# EAGLE design schema (EAGLE 9.6.2)
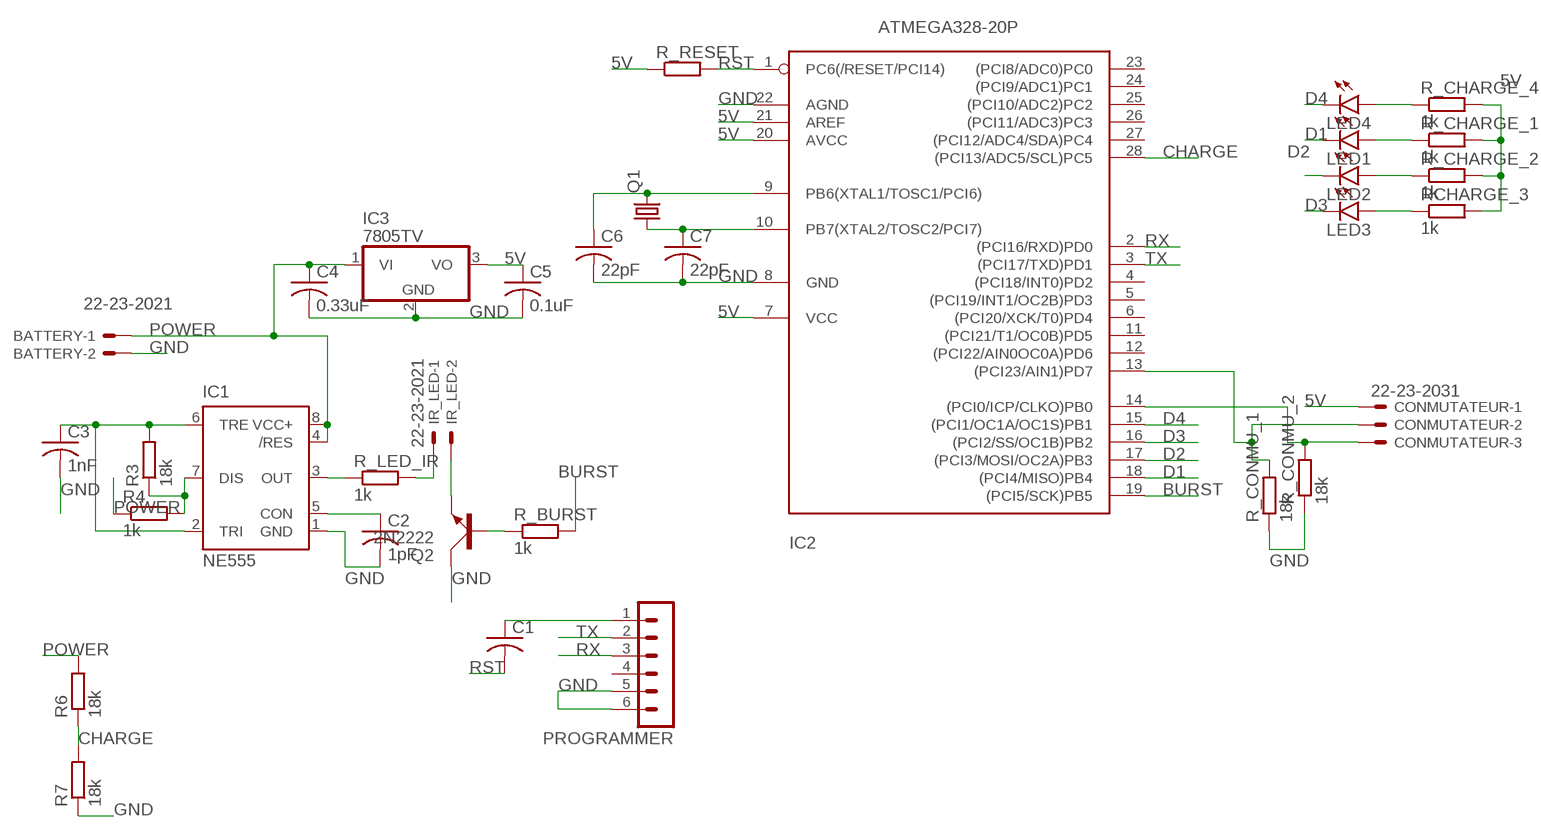
[diagram p0: schematic, sheet 1]

## Parts
BATTERY  22-23-2021  [22-23-2021]
C1  C-US050-024X044  [C050-024X044]
C2  1pF  C-US050-024X044  [C050-024X044]
C3  1nF  C-US050-024X044  [C050-024X044]
C4  0.33uF  C-US050-024X044  [C050-024X044]
C5  0.1uF  C-US050-024X044  [C050-024X044]
C6  22pF  C-US050-024X044  [C050-024X044]
C7  22pF  C-US050-024X044  [C050-024X044]
CONMUTATEUR  22-23-2031  [22-23-2031]
IC1  NE555  [DIL-08]
IC2  ATMEGA328-20P  [DIL28-3]
IC3  7805TV  [TO220V]
IR_LED  22-23-2021  [22-23-2021]
LED1  LED5MM  [LED5MM]
LED2  LED5MM  [LED5MM]
LED3  LED5MM  [LED5MM]
LED4  LED5MM  [LED5MM]
PROGRAMMER  MA06-1  [MA06-1]
Q1  CRYSTALHC49S  [HC49/S]
Q2  2N2222  [TO18A]
R3  18k  R-EU_0207/7  [0207/7]
R4  1k  R-EU_0207/7  [0207/7]
R6  18k  R-EU_0207/7  [0207/7]
R7  18k  R-EU_0207/7  [0207/7]
R_BURST  1k  R-EU_0207/7  [0207/7]
R_CHARGE_1  1k  R-EU_0207/7  [0207/7]
R_CHARGE_2  1k  R-EU_0207/7  [0207/7]
R_CHARGE_4  1k  R-EU_0207/7  [0207/7]
R_CONMU_1  18k  R-EU_0207/7  [0207/7]
R_CONMU_2  18k  R-EU_0207/7  [0207/7]
R_LED_IR  1k  R-EU_0207/7  [0207/7]
R_RESET  R-EU_0207/7  [0207/7]
RCHARGE_3  1k  R-EU_0207/7  [0207/7]

## Nets
5V: C5.1 CONMUTATEUR.1 IC2.7(VCC) IC2.20(AVCC) IC2.21(AREF) IC3.3(VO) R_CHARGE_1.2 R_CHARGE_2.2 R_CHARGE_4.2 R_RESET.1 RCHARGE_3.2
BURST: IC2.19((PCI5/SCK)PB5) R_BURST.2
CHARGE: IC2.28((PCI13/ADC5/SCL)PC5) R6.1 R7.2
D1: IC2.18((PCI4/MISO)PB4) LED1.K(C)
D2: IC2.17((PCI3/MOSI/OC2A)PB3) LED2.K(C)
D3: IC2.16((PCI2/SS/OC1B)PB2) LED3.K(C)
D4: IC2.15((PCI1/OC1A/OC1S)PB1) LED4.K(C)
GND: BATTERY.2 C2.2 C3.2 C4.2 C5.2 C6.2 C7.2 IC1.1(GND) IC2.8(GND) IC2.22(AGND) IC3.2(GND) PROGRAMMER.5 PROGRAMMER.6 Q2.C R7.1 R_CONMU_1.1 R_CONMU_2.1
N$1: IR_LED.1 R_LED_IR.2
N$2: IC1.3(OUT) R_LED_IR.1
N$3: C2.1 IC1.5(CON)
N$4: IC1.7(DIS) R3.1 R4.2
N$5: C3.1 IC1.2(TRI) IC1.6(TRE) R3.2
N$6: IR_LED.2 Q2.E
N$8: CONMUTATEUR.2 IC2.13((PCI23/AIN1)PD7) R_CONMU_1.2
N$9: C7.1 IC2.10(PB7(XTAL2/TOSC2/PCI7)) Q1.1
N$10: C6.1 IC2.9(PB6(XTAL1/TOSC1/PCI6)) Q1.2
N$11: Q2.B R_BURST.1
N$12: CONMUTATEUR.3 IC2.14((PCI0/ICP/CLKO)PB0) R_CONMU_2.2
N$15: LED3.A RCHARGE_3.1
N$16: LED2.A R_CHARGE_2.1
N$17: LED1.A R_CHARGE_1.1
N$18: LED4.A R_CHARGE_4.1
N$19: C1.1 PROGRAMMER.1
POWER: BATTERY.1 C4.1 IC1.4(/RES) IC1.8(VCC+) IC3.1(VI) R4.1 R6.2
RST: C1.2 IC2.1(PC6(/RESET/PCI14)) R_RESET.2
RX: IC2.2((PCI16/RXD)PD0) PROGRAMMER.3
TX: IC2.3((PCI17/TXD)PD1) PROGRAMMER.2
Unconnected: IC2.4((PCI18/INT0)PD2) IC2.5((PCI19/INT1/OC2B)PD3) IC2.6((PCI20/XCK/T0)PD4) IC2.11((PCI21/T1/OC0B)PD5) IC2.12((PCI22/AIN0OC0A)PD6) IC2.23((PCI8/ADC0)PC0) IC2.24((PCI9/ADC1)PC1) IC2.25((PCI10/ADC2)PC2) IC2.26((PCI11/ADC3)PC3) IC2.27((PCI12/ADC4/SDA)PC4) PROGRAMMER.4

## Library data of the parts
BATTERY IR_LED = con-molex:22-23-2021: .100" (2.54mm) Center Header - 2 Pin; MF: MOLEX; MPN: 22-23-2021; OC_FARNELL: 1462926; OC_NEWARK: 25C3832
C1-C7 = rcl:C-US: CAPACITOR, American symbol; SPICEPREFIX: C
CONMUTATEUR = con-molex:22-23-2031: .100" (2.54mm) Center Header - 3 Pin; MF: MOLEX; MPN: 22-23-2031; OC_FARNELL: 1462950; OC_NEWARK: 30C0862
IC1 = st-microelectronics:NE555: General purpose bipolar Timer; MF: Arrow Electronics; MPN: NE555N; OC_FARNELL: 1467742; OC_NEWARK: 89K1486
IC2 = atmega328:ATMEGA328*P: MICROCONTROLLER 32 kBytes FLASH 2 kBytes SRAM 1 kBytes EEPROM USART 8-channel 10 bit ADC
IC3 = linear:78*: Positive VOLTAGE REGULATOR Source: http://cache.national.com/ds/LM/LM78L05.pdf http://www.fairchildsemi.com/ds/LM/LM7805.pdf
LED1-LED4 = led:LED: LED OSRAM: - CHIPLED LG R971, LG N971, LY N971, LG Q971, LY Q971, LO R971, LY R971 LH N974, LH R974 LS Q976, LO Q976, LY Q976 LO Q996 - Hyper CHIPLED LW Q18S LB Q993, LB Q99A, LB R99A - SideLED LS A670, LO A670, LY A670, LG A670, LP A670 LB A673, LV A673, LT A673, LW A673 LH A674 LY A675 LS A676, LA A676, LO A676, LY A676, LW A676 LS A679, LY A679, LG A679 - Hyper Micro SIDELED® LS Y876, LA Y876, LO Y876, LY Y876 LT Y87S - SmartLED LW L88C, LW L88S LB L89C, LB L89S, LG L890 LS L89K, LO L89K, LY L89K LS L896, LA L896, LO L896, LY L896 - TOPLED LS T670, LO T670, LY T670, LG T670, LP T670 LSG T670, LSP T670, LSY T670, LOP T670, LYG T670 LG T671, LOG T671, LSG T671 LB T673, LV T673, LT T673, LW T673 LH T674 LS T676, LA T676, LO T676, LY T676, LB T676, LH T676, LSB T676, LW T676 LB T67C, LV T67C, LT T67C, LS T67K, LO T67K, LY T67K, LW E67C LS E67B, LA E67B, LO E67B, LY E67B, LB E67C, LV E67C, LT E67C LW T67C LS T679, LY T679, LG T679 LS T770, LO T770, LY T770, LG T770, LP T770 LB T773, LV T773, LT T773, LW T773 LH T774 LS E675, LA E675, LY E675, LS T675 LS T776, LA T776, LO T776, LY T776, LB T776 LHGB T686 LT T68C, LB T68C - Hyper Mini TOPLED® LB M676 - Mini TOPLED Santana® LG M470 LS M47K, LO M47K, LY M47K Source: http://www.osram.convergy.de LUXEON: - LUMILED® LXK2-PW12-R00, LXK2-PW12-S00, LXK2-PW14-U00, LXK2-PW14-V00 LXK2-PM12-R00, LXK2-PM12-S00, LXK2-PM14-U00 LXK2-PE12-Q00, LXK2-PE12-R00, LXK2-PE12-S00, LXK2-PE14-T00, LXK2-PE14-U00 LXK2-PB12-K00, LXK2-PB12-L00, LXK2-PB12-M00, LXK2-PB14-N00, LXK2-PB14-P00, LXK2-PB14-Q00 LXK2-PR12-L00, LXK2-PR12-M00, LXK2-PR14-Q00, LXK2-PR14-R00 LXK2-PD12-Q00, LXK2-PD12-R00, LXK2-PD12-S00 LXK2-PH12-R00, LXK2-PH12-S00 LXK2-PL12-P00, LXK2-PL12-Q00, LXK2-PL12-R00 Source: www.luxeon.com KINGBRIGHT: KA-3528ASYC Source: www.kingbright.com
PROGRAMMER = con-lstb:MA06-1: PIN HEADER; OC_FARNELL: unknown; OC_NEWARK: unknown
Q1 = crystal:CRYSTAL: CRYSTAL; OC_FARNELL: 1667008; OC_NEWARK: unknown
Q2 = transistor-small-signal:2N2222: NPN TRANSISTOR
R3 R4 R6 R7 R_BURST R_CHARGE_1 R_CHARGE_2 R_CHARGE_4 R_CONMU_1 R_CONMU_2 R_LED_IR R_RESET RCHARGE_3 = rcl:R-EU_: RESISTOR, European symbol; SPICEPREFIX: R

## Board
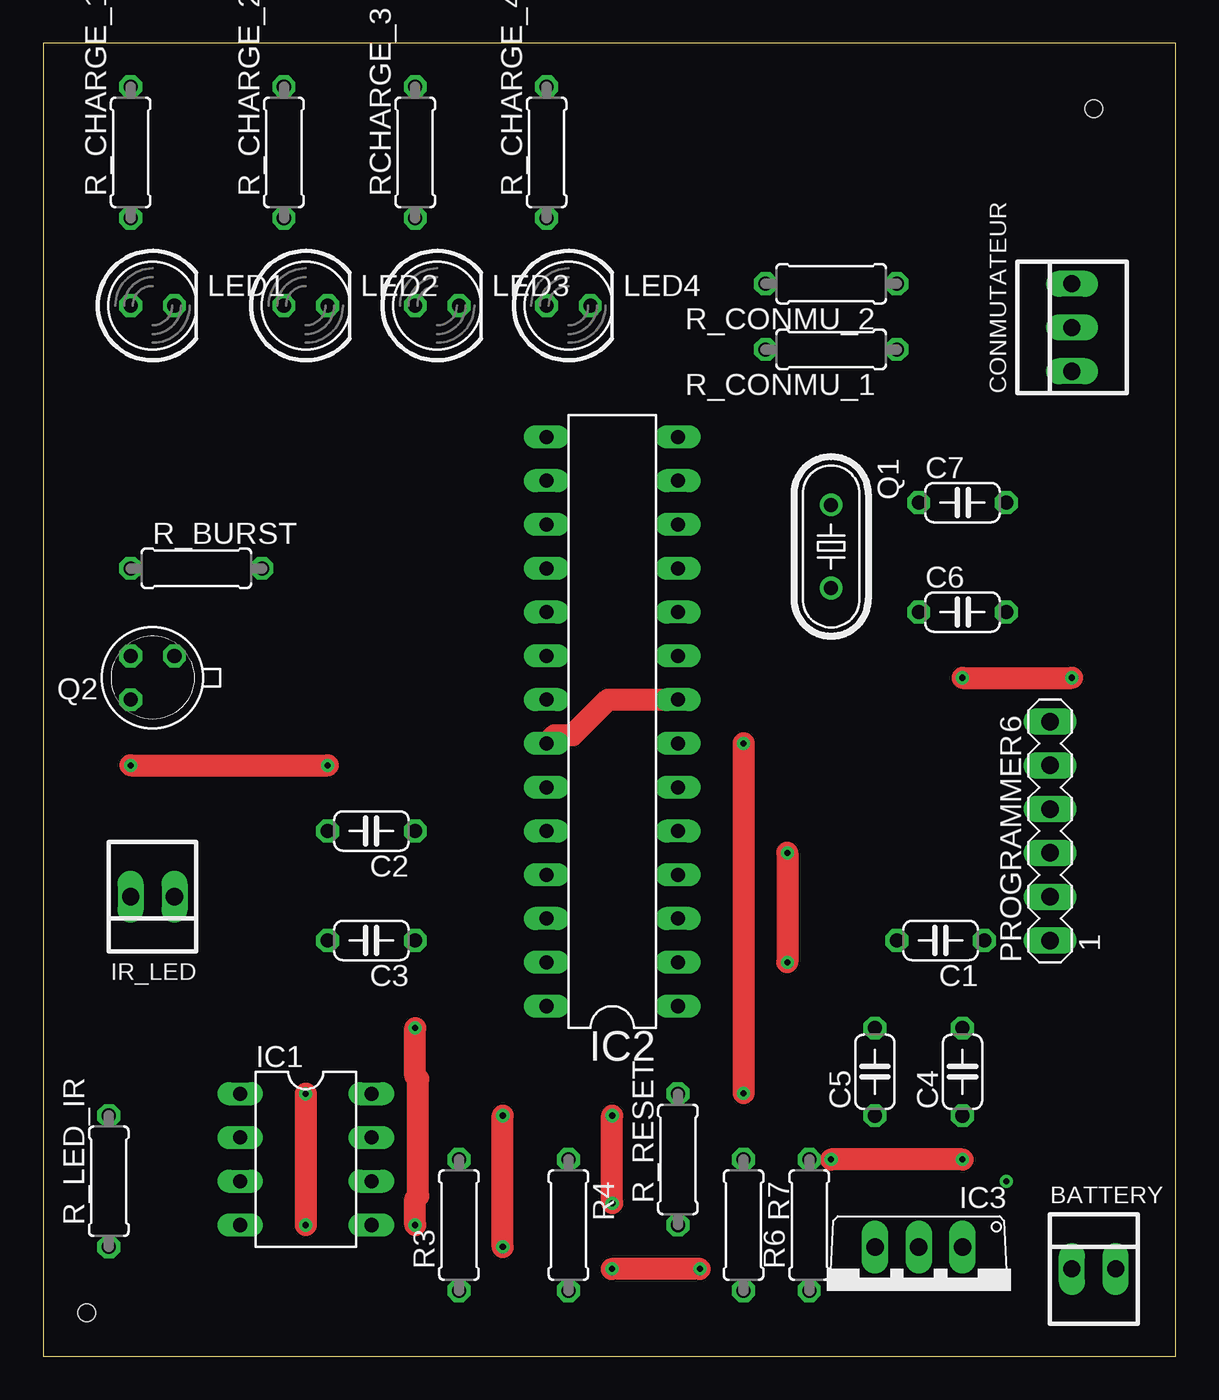
[diagram p1: board, top side]
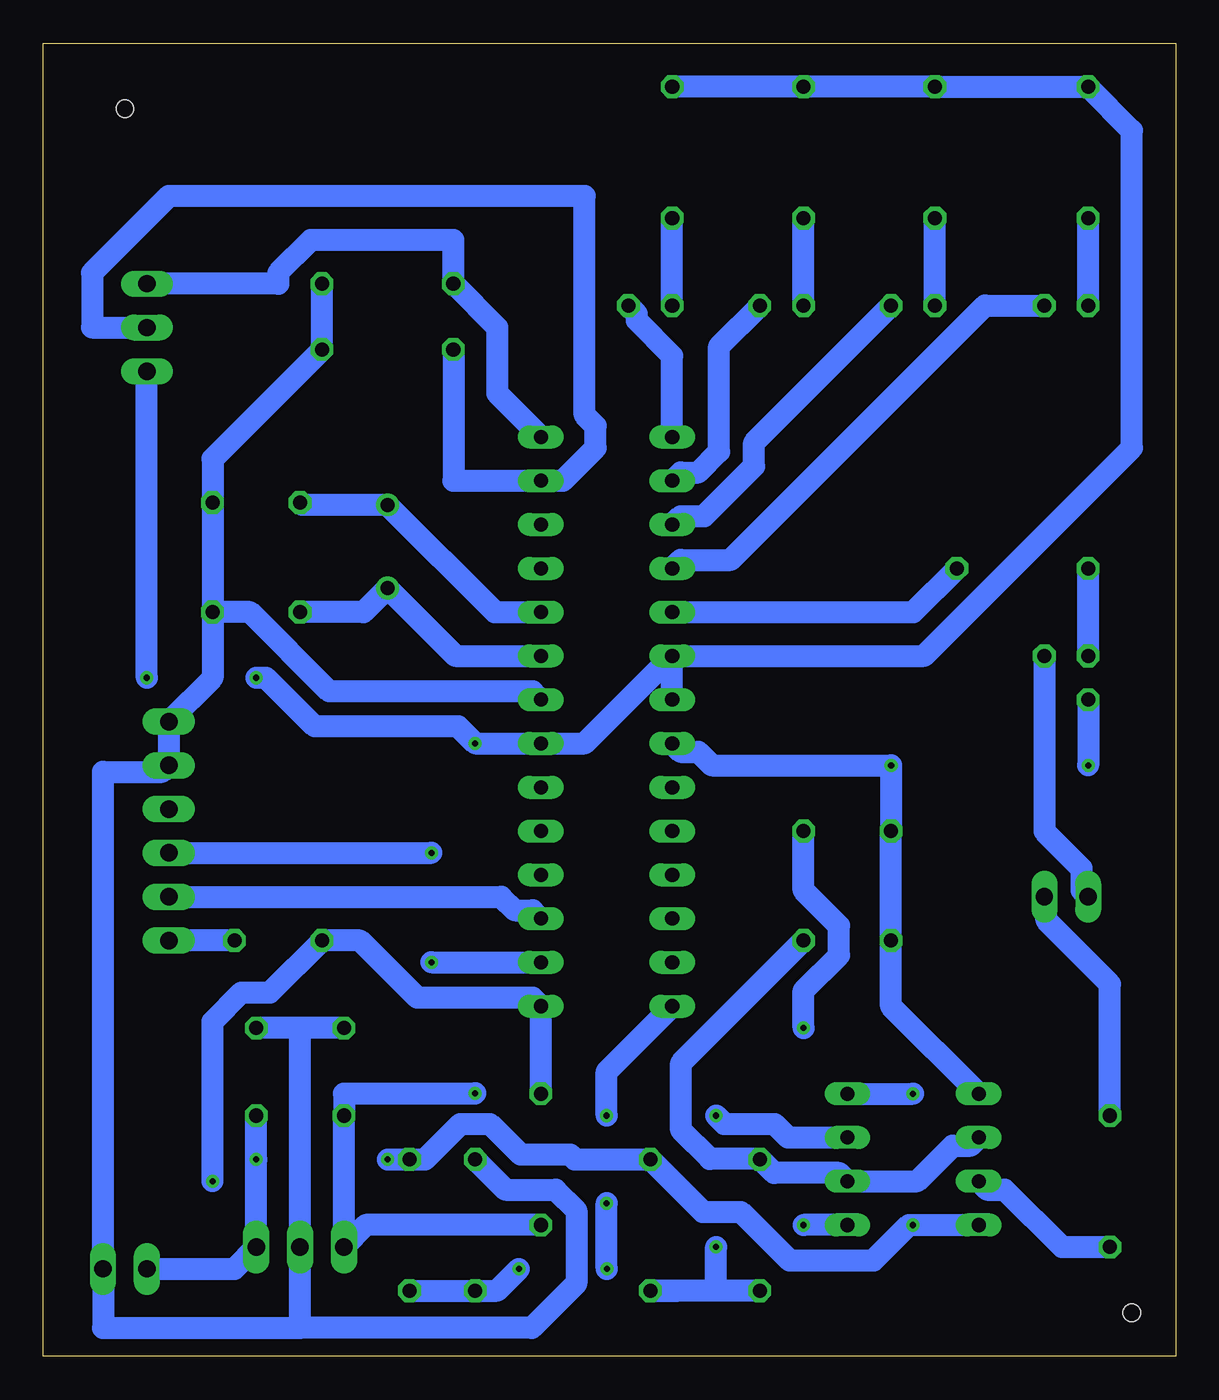
[diagram p2: board, bottom side, seen from below]

Size 65.71 x 76.19 mm. Coordinates in mm from the lower left corner, seen from the top.
Outline: 0,0 65.71,0 65.71,76.19 0,76.19 0,0
Copper layers (1*16): Top 0.035mm / dielectric 1.5mm / Bottom 0.035mm
Design rules "default *": minimum track width 50mil, minimum drill 0.35mm, track to track 30mil, track to pad 30mil, pad to pad 30mil, via to via 30mil, smd to smd 6mil, copper to edge 40mil, drill to drill 6mil, minimum pad ring 10mil, minimum via ring 8mil, stop-mask expansion 4mil, vias tented up to drill 0mil, thermal gap 10mil
Holes 1 mm at 60.96,72.39 2.54,2.54

### Footprints (pad centres in the part's own frame; a part is rotated, then mirrored left to right if it is on the bottom)
22-23-2021 = drill 1 long: 1 -1.27,0; 2 1.27,0
C050-024X044 = drill 0.813 octagon: 1 -2.54,0; 2 2.54,0
22-23-2031 = drill 1 long: 1 -2.54,0; 2 0,0; 3 2.54,0
DIL-08 = drill 0.813 long: 1 -3.81,-3.81; 2 -1.27,-3.81; 3 1.27,-3.81; 4 3.81,-3.81; 5 3.81,3.81; 6 1.27,3.81; 7 -1.27,3.81; 8 -3.81,3.81
DIL28-3 = drill 0.813 long: 1 -16.51,-3.81; 2 -13.97,-3.81; 3 -11.43,-3.81; 4 -8.89,-3.81; 5 -6.35,-3.81; 6 -3.81,-3.81; 7 -1.27,-3.81; 8 1.27,-3.81; 9 3.81,-3.81; 10 6.35,-3.81; 11 8.89,-3.81; 12 11.43,-3.81; 13 13.97,-3.81; 14 16.51,-3.81; 15 16.51,3.81; 16 13.97,3.81; 17 11.43,3.81; 18 8.89,3.81; 19 6.35,3.81; 20 3.81,3.81; 21 1.27,3.81; 22 -1.27,3.81; 23 -3.81,3.81; 24 -6.35,3.81; 25 -8.89,3.81; 26 -11.43,3.81; 27 -13.97,3.81; 28 -16.51,3.81
TO220V = drill 1.016 long: 1 -2.54,-2.54; 2 0,-2.54; 3 2.54,-2.54
LED5MM = drill 0.813 octagon: A -1.27,0; K 1.27,0
MA06-1 = drill 1.016 long: 1 -6.35,0; 2 -3.81,0; 3 -1.27,0; 4 1.27,0; 5 3.81,0; 6 6.35,0
HC49/S = drill 0.813: 1 -2.413,0; 2 2.413,0
TO18A = drill 0.813 octagon: B 1.27,-1.27; C 1.27,1.27; E -1.27,-1.27
0207/7 = drill 0.813 octagon: 1 -3.81,0; 2 3.81,0

### Placement (x,y rotation side)
BATTERY  60.96,5.08 0 top
C1  52.07,24.13 180 top
C2  19.05,30.48 180 top
C3  19.05,24.13 180 top
C4  53.34,16.51 90 top
C5  48.26,16.51 90 top
C6  53.34,43.18 0 top
C7  53.34,49.53 0 top
CONMUTATEUR  59.69,59.69 90 top
IC1  15.24,11.43 270 top
IC2  33.02,36.83 90 top
IC3  50.8,3.81 180 top
IR_LED  6.35,26.67 180 top
LED1  6.35,60.96 0 top
LED2  15.24,60.96 0 top
LED3  22.86,60.96 0 top
LED4  30.48,60.96 0 top
PROGRAMMER  58.42,30.48 90 top
Q1  45.72,46.99 270 top
Q2  6.35,39.37 180 top
R3  24.13,7.62 90 top
R4  30.48,7.62 270 top
R6  44.45,7.62 90 top
R7  40.64,7.62 270 top
R_BURST  8.89,45.72 0 top
R_CHARGE_1  5.08,69.85 90 top
R_CHARGE_2  13.97,69.85 90 top
R_CHARGE_4  29.21,69.85 90 top
R_CONMU_1  45.72,58.42 180 top
R_CONMU_2  45.72,62.23 180 top
R_LED_IR  3.81,10.16 90 top
R_RESET  36.83,11.43 90 top
RCHARGE_3  21.59,69.85 90 top

### Tracks (layer width: path | path; a pad name or v marks a point on that pad's centre or on a via)
5V  (via drill 0.35)
  Top 1.27: v53.34,39.37 v59.69,39.37 | v40.64,35.56 v40.64,15.26
  Bottom 1.27: IC2.21 IC2.20 | R_RESET.1 46.99,7.62 IC3.3 C5.1 48.26,15.24 40.66,15.24 v40.64,15.26 | IC2.20 34.29,35.56 IC2.7 v40.64,35.56 41.63,36.55 49.95,36.55 52.77,39.37 v53.34,39.37 | v59.69,39.37 CONMUTATEUR.1 | R_CHARGE_4.2 RCHARGE_3.2 R_CHARGE_2.2 R_CHARGE_1.2 2.54,71.12 2.54,52.7 14.61,40.64 IC2.20
BURST
  Bottom 1.27: IC2.19 15.24,43.18 R_BURST.2
CHARGE  (via drill 0.35)
  Top 1.27: v38.1,5.08 v33,5.08 | v33.02,8.89 v33.02,13.97
  Bottom 1.27: R6.1 R7.2 39.37,3.81 v38.1,5.08 | v33,5.08 33.02,5.1 v33.02,8.89 | v33.02,13.97 33.02,16.51 IC2.28
D1
  Bottom 1.27: IC2.18 28.73,46.2 25.82,46.2 11.06,60.96 LED1.K
D2
  Bottom 1.27: IC2.17 28.73,48.74 27.36,48.74 24.46,51.65 24.46,53.01 LED2.K
D3
  Bottom 1.27: IC2.16 28.73,51.28 27.7,51.28 26.49,52.49 26.49,58.6 LED3.K
D4
  Bottom 1.27: LED4.K 31.27,60.48 31.27,60.11 29.21,58.05 IC2.15
GND  (via drill 0.35)
  Top 1.27: v5.08,34.29 v16.51,34.29 | IC2.22 29.69,36.04 30.72,36.04 32.78,38.1 IC2.8
  Bottom 1.27: 50.8,19.05 IC3.2 50.8,1.65 | 50.8,19.05 C4.2 | C5.2 50.8,19.05 | 50.8,1.65 62.23,1.65 BATTERY.2 62.23,33.91 58.8,33.91 PROGRAMMER.5 PROGRAMMER.6 55.88,39.37 C6.2 | C6.2 C7.2 55.88,52.07 R_CONMU_1.1 R_CONMU_2.1 | R7.1 38.89,9.68 35.98,9.68 34.77,8.47 34.77,4.23 37.35,1.65 50.8,1.65 | IC1.1 16.51,20.32 C3.2 C2.2 v16.51,34.29 26.91,34.29 27.7,35.08 28.73,35.08 IC2.22 | Q2.C v5.08,34.29 | IC2.8 37.31,38.58 49.11,38.58 53.71,43.18 C6.2
N$1
  Bottom 1.27: IR_LED.1 7.5,26.55 7.5,25.3 3.81,21.6 R_LED_IR.2
N$2
  Bottom 1.27: IC1.3 10.95,9.68 9.92,9.68 6.59,6.35 R_LED_IR.1
N$3  (via drill 0.35)
  Top 1.27: v21.59,7.62 21.59,9.13 21.77,9.31 21.77,16.09 21.59,16.27 v21.59,19.05
  Bottom 1.27: IC1.5 v21.59,7.62 | C2.1 21.59,27.04 19.53,24.98 19.53,23.28 21.59,21.22 v21.59,19.05
N$4  (via drill 0.35)
  Top 1.27: v26.67,6.35 v26.67,13.97
  Bottom 1.27: 28.84,3.81 R4.2 26.67,3.81 | R3.1 26.67,3.81 | 26.67,3.81 v26.67,6.35 | IC1.7 22.49,12.7 23.28,13.49 26.19,13.49 v26.67,13.97
N$5
  Bottom 1.27: R3.2 24.16,11.46 | 24.16,11.46 27.03,11.46 28.7,13.13 28.7,17.02 C3.1 | 24.16,11.46 24.12,11.46 23.31,10.64 19.53,10.64 IC1.6 15,10.16 12.94,12.22 11.91,12.22 IC1.2
N$6
  Bottom 1.27: IR_LED.2 5.47,27.06 5.47,28.32 7.62,30.47 Q2.E
N$8
  Bottom 1.27: R_CONMU_1.2 41.91,50.8 IC2.13 35.56,50.8 33.66,52.7 33.66,53.98 34.29,54.61 34.29,67.31 58.42,67.31 62.87,62.87 62.87,59.69 CONMUTATEUR.2
N$9
  Bottom 1.27: IC2.10 39.5,43.18 Q1.1 50.67,49.4 C7.1
N$10
  Bottom 1.27: IC2.9 41.78,40.64 Q1.2 47.12,43.18 C6.1
N$11
  Bottom 1.27: Q2.B R_BURST.1
N$12
  Bottom 1.27: IC2.14 39.37,55.88 39.37,59.69 R_CONMU_2.2 41.91,64.77 50.16,64.77 52.07,62.87 52.07,62.23 CONMUTATEUR.3
N$15
  Bottom 1.27: LED3.A RCHARGE_3.1
N$16
  Bottom 1.27: LED2.A R_CHARGE_2.1
N$17
  Bottom 1.27: LED1.A R_CHARGE_1.1
N$18
  Bottom 1.27: LED4.A R_CHARGE_4.1
N$19
  Bottom 1.27: C1.1 PROGRAMMER.1
POWER  (via drill 0.35)
  Top 1.27: v53.34,11.43 v45.72,11.43 | v15.24,15.24 v15.24,7.62
  Bottom 1.27: C4.1 v53.34,11.43 IC3.1 54.61,5.08 BATTERY.1 | v45.72,11.43 R6.2 43.55,11.43 41.49,13.49 39.79,13.49 38.01,11.71 35.14,11.71 34.86,11.43 R4.1 27.43,8.38 25.23,8.38 22.41,5.56 17.54,5.56 15.48,7.62 v15.24,7.62 IC1.4 | IC1.8 v15.24,15.24
RST  (via drill 0.35)
  Bottom 1.27: v55.88,10.16 55.88,19.42 54.19,21.11 52.55,21.11 C1.2 47.32,24.13 44,20.8 37.31,20.8 IC2.1 R_RESET.2
RX  (via drill 0.35)
  Top 1.27: v43.18,29.21 v43.18,22.86
  Bottom 1.27: PROGRAMMER.3 v43.18,29.21 | v43.18,22.86 IC2.2
TX
  Bottom 1.27: PROGRAMMER.2 39.13,26.67 38.34,25.88 37.31,25.88 IC2.3